# EAGLE design hs-usb-wing (EAGLE 5.06)
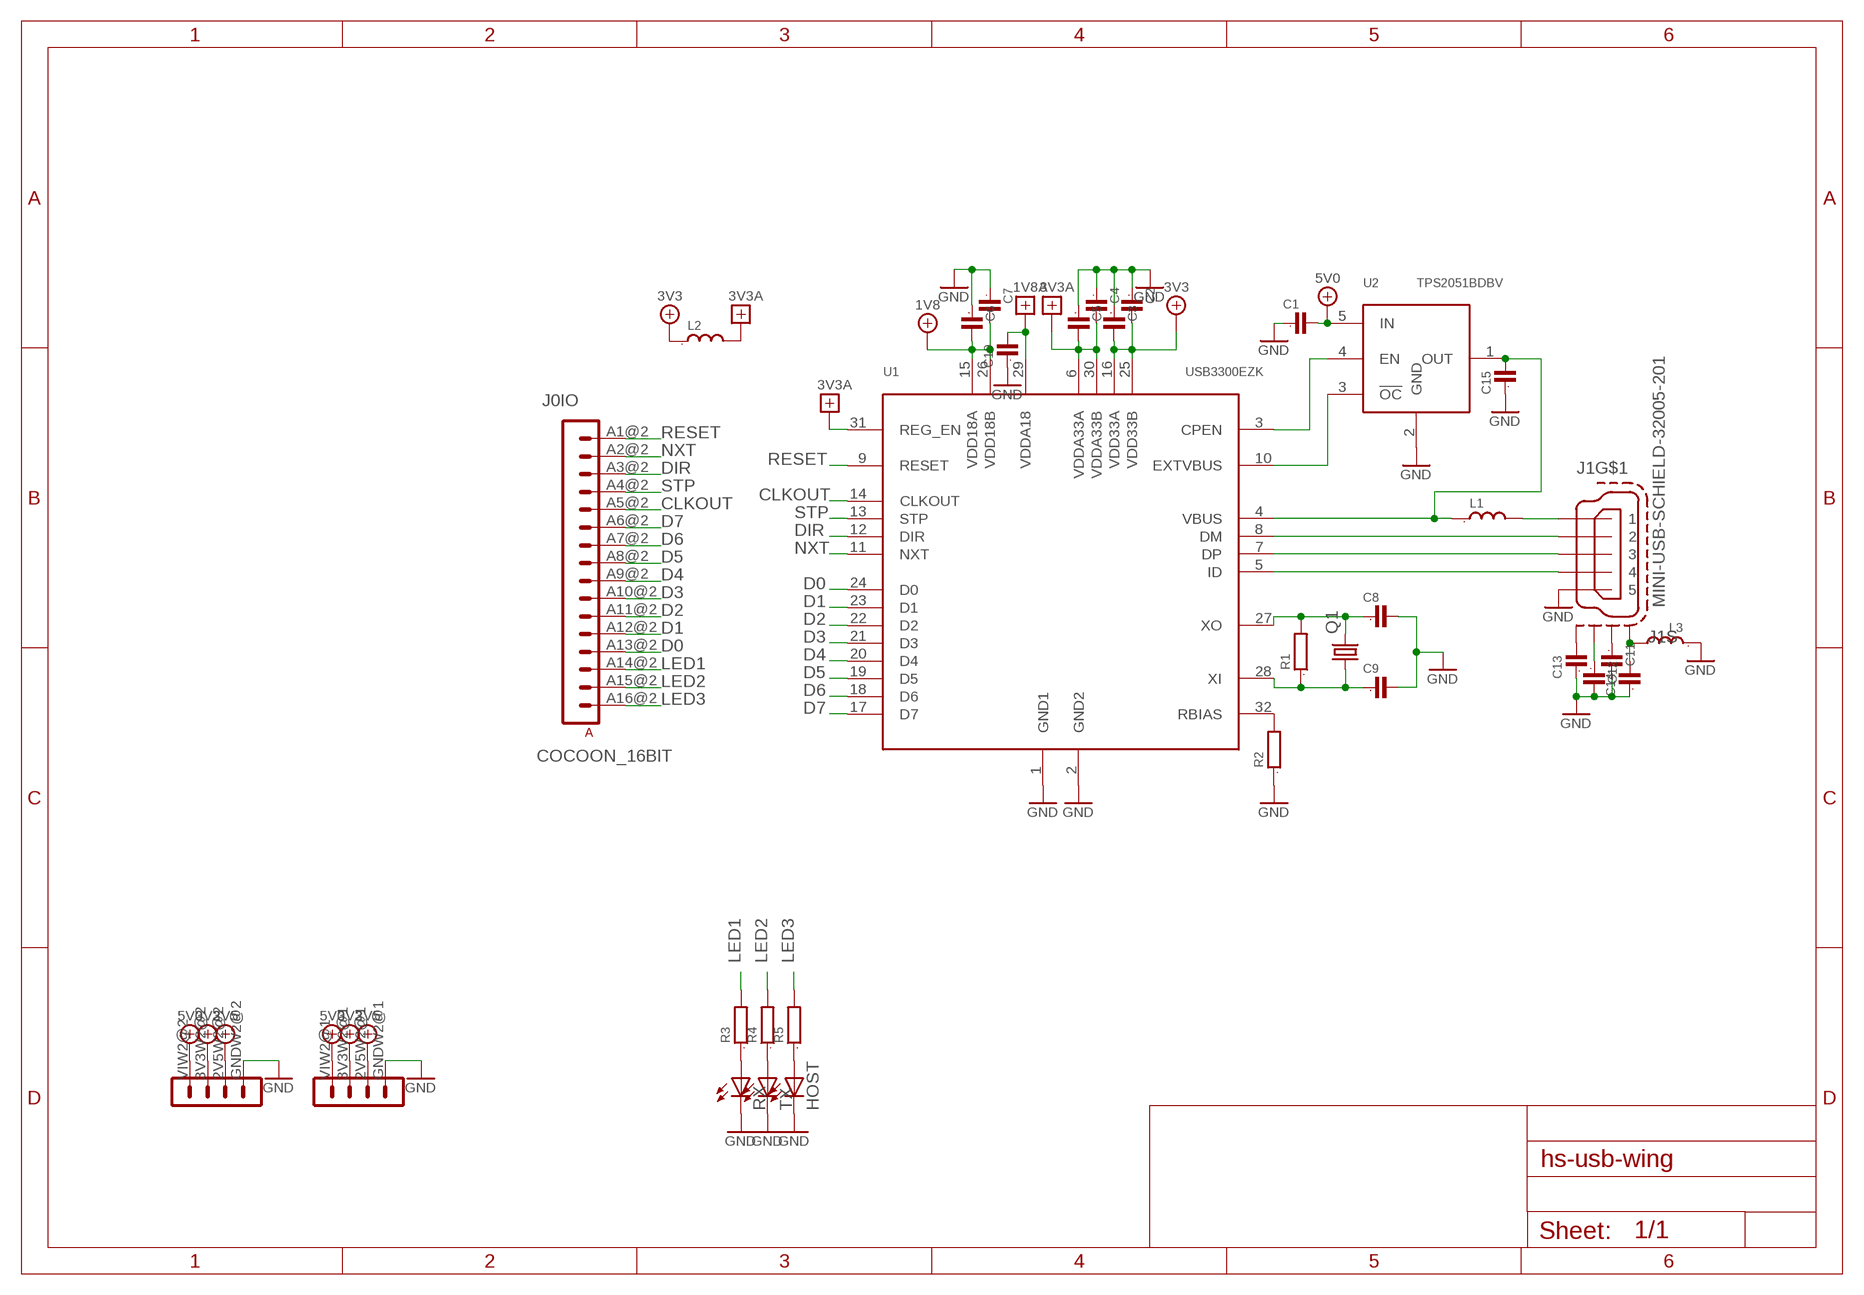
[diagram p0: schematic, sheet 1]

## Parts
C1  C0603  [0603]
C2  C0603  [0603]
C3  C0603  [0603]
C4  C0603  [0603]
C5  C0603  [0603]
C6  C0603  [0603]
C7  C0603  [0603]
C8  C0603  [0603]
C9  C0603  [0603]
C10  C0603  [0603]
C11  C0603  [0603]
C12  C0603  [0603]
C13  C0603  [0603]
C14  C0603  [0603]
C15  C0603  [0603]
HOST  LEDCHIP-LED0603  [CHIP-LED0603]
J0  COCOON_16BIT  [COCOON_16BIT_LEFT]
J1  MINI-USB-SCHIELD-32005-201  [32005-201]
L1  L0805  [0805]
L2  L0805  [0805]
L3  L0805  [0805]
Q1  CRYSTALHC49S  [HC49/S]
R1  R0603  [0603]
R2  R0603  [0603]
R3  R0603  [0603]
R4  R0603  [0603]
R5  R0603  [0603]
RX  LEDCHIP-LED0603  [CHIP-LED0603]
TX  LEDCHIP-LED0603  [CHIP-LED0603]
U1  USB3300EZK  [QFN32]
U2  TPS2051BDBV  [SOT23-DBV]

## Nets
1V8: C6.2 C7.2 U1.15(VDD18A) U1.26(VDD18B)
1V8A: C10.2 U1.29(VDDA18)
2V5: J0.2V5W2@1(PWRH:2V5) J0.2V5W2@2(PWRL:2V5)
3V3: C2.2 C3.2 J0.3V3W2@1(PWRH:3V3) J0.3V3W2@2(PWRL:3V3) L2.1 U1.16(VDD33A) U1.25(VDD33B)
3V3A: C4.2 C5.2 L2.2 U1.6(VDDA33A) U1.30(VDDA33B) U1.31(REG_EN)
5V0: C1.2 J0.VIW2@1(PWRH:5V) J0.VIW2@2(PWRL:5V) U2.5(IN)
CLKOUT: J0.A5@2(IO:A5) U1.14(CLKOUT)
D0: J0.A13@2(IO:A13) U1.24(D0)
D1: J0.A12@2(IO:A12) U1.23(D1)
D2: J0.A11@2(IO:A11) U1.22(D2)
D3: J0.A10@2(IO:A10) U1.21(D3)
D4: J0.A9@2(IO:A9) U1.20(D4)
D5: J0.A8@2(IO:A8) U1.19(D5)
D6: J0.A7@2(IO:A7) U1.18(D6)
D7: J0.A6@2(IO:A6) U1.17(D7)
DIR: J0.A3@2(IO:A3) U1.12(DIR)
DM: J1.2 U1.8(DM)
DP: J1.3 U1.7(DP)
GND: C1.1 C2.1 C3.1 C4.1 C5.1 C6.1 C7.1 C8.2 C9.2 C10.1 C11.2 C12.2 C13.1 C14.1 C15.1 HOST.C J0.GNDW2@1(PWRH:GND) J0.GNDW2@2(PWRL:GND) J1.5 L3.1 R2.1 RX.C TX.C U1.1(GND1) U1.2(GND2) U2.2(GND)
ID: J1.4 U1.5(ID)
LED1: J0.A14@2(IO:A14) R3.2
LED2: J0.A15@2(IO:A15) R4.2
LED3: J0.A16@2(IO:A16) R5.2
N$1: R3.1 RX.A
N$2: J1.1 L1.2
N$3: R4.1 TX.A
N$5: R2.2 U1.32(RBIAS)
N$6: C8.1 Q1.2 R1.2 U1.27(XO)
N$7: C9.1 Q1.1 R1.1 U1.28(XI)
N$8: HOST.A R5.1
N$9: C13.2 J1.M1(S:S1)
N$10: C12.1 J1.M2(S:S2)
N$11: C11.1 J1.M3(S:S3)
N$12: C14.2 J1.M4(S:S4) L3.2
N$38: U1.3(CPEN) U2.4(EN)
N$39: U1.10(EXTVBUS) U2.3(!OC)
NXT: J0.A2@2(IO:A2) U1.11(NXT)
RESET: J0.A1@2(IO:A1) U1.9(RESET)
STP: J0.A4@2(IO:A4) U1.13(STP)
VBUS: C15.2 L1.1 U1.4(VBUS) U2.1(OUT)

## Library data of the parts
C1-C15 = GadgetFactory:C: CAPACITOR, European symbol
HOST RX TX = led:LED: LED OSRAM: - CHIPLED LG R971, LG N971, LY N971, LG Q971, LY Q971, LO R971, LY R971 LH N974, LH R974 LS Q976, LO Q976, LY Q976 LO Q996 - Hyper CHIPLED LW Q18S LB Q993, LB Q99A, LB R99A - SideLED LS A670, LO A670, LY A670, LG A670, LP A670 LB A673, LV A673, LT A673, LW A673 LH A674 LY A675 LS A676, LA A676, LO A676, LY A676, LW A676 LS A679, LY A679, LG A679 - Hyper Micro SIDELED® LS Y876, LA Y876, LO Y876, LY Y876 LT Y87S - SmartLED LW L88C, LW L88S LB L89C, LB L89S, LG L890 LS L89K, LO L89K, LY L89K LS L896, LA L896, LO L896, LY L896 - TOPLED LS T670, LO T670, LY T670, LG T670, LP T670 LSG T670, LSP T670, LSY T670, LOP T670, LYG T670 LG T671, LOG T671, LSG T671 LB T673, LV T673, LT T673, LW T673 LH T674 LS T676, LA T676, LO T676, LY T676, LB T676, LH T676, LSB T676, LW T676 LB T67C, LV T67C, LT T67C, LS T67K, LO T67K, LY T67K, LW E67C LS E67B, LA E67B, LO E67B, LY E67B, LB E67C, LV E67C, LT E67C LW T67C LS T679, LY T679, LG T679 LS T770, LO T770, LY T770, LG T770, LP T770 LB T773, LV T773, LT T773, LW T773 LH T774 LS E675, LA E675, LY E675, LS T675 LS T776, LA T776, LO T776, LY T776, LB T776 LHGB T686 LT T68C, LB T68C - Hyper Mini TOPLED® LB M676 - Mini TOPLED Santana® LG M470 LS M47K, LO M47K, LY M47K Source: http://www.osram.convergy.de LUXEON: - LUMILED® LXK2-PW12-R00, LXK2-PW12-S00, LXK2-PW14-U00, LXK2-PW14-V00 LXK2-PM12-R00, LXK2-PM12-S00, LXK2-PM14-U00 LXK2-PE12-Q00, LXK2-PE12-R00, LXK2-PE12-S00, LXK2-PE14-T00, LXK2-PE14-U00 LXK2-PB12-K00, LXK2-PB12-L00, LXK2-PB12-M00, LXK2-PB14-N00, LXK2-PB14-P00, LXK2-PB14-Q00 LXK2-PR12-L00, LXK2-PR12-M00, LXK2-PR14-Q00, LXK2-PR14-R00 LXK2-PD12-Q00, LXK2-PD12-R00, LXK2-PD12-S00 LXK2-PH12-R00, LXK2-PH12-S00 LXK2-PL12-P00, LXK2-PL12-Q00, LXK2-PL12-R00 Source: www.luxeon.com KINGBRIGHT: KA-3528ASYC Source: www.kingbright.com
J0 = usb1:COCOON_16BIT
J1 = con-cypressindustries:MINI-USB-SCHIELD-: MINI USB-B Conector Source: www.cypressindustries.com
L1-L3 = GadgetFactory:L: INDUCTOR, European symbol
Q1 = usb1:CRYSTAL: CRYSTAL
R1-R5 = GadgetFactory:R: RESISTOR, European symbol
U1 = usb1:USB3300
U2 = usb1:TPS2051B

## Board
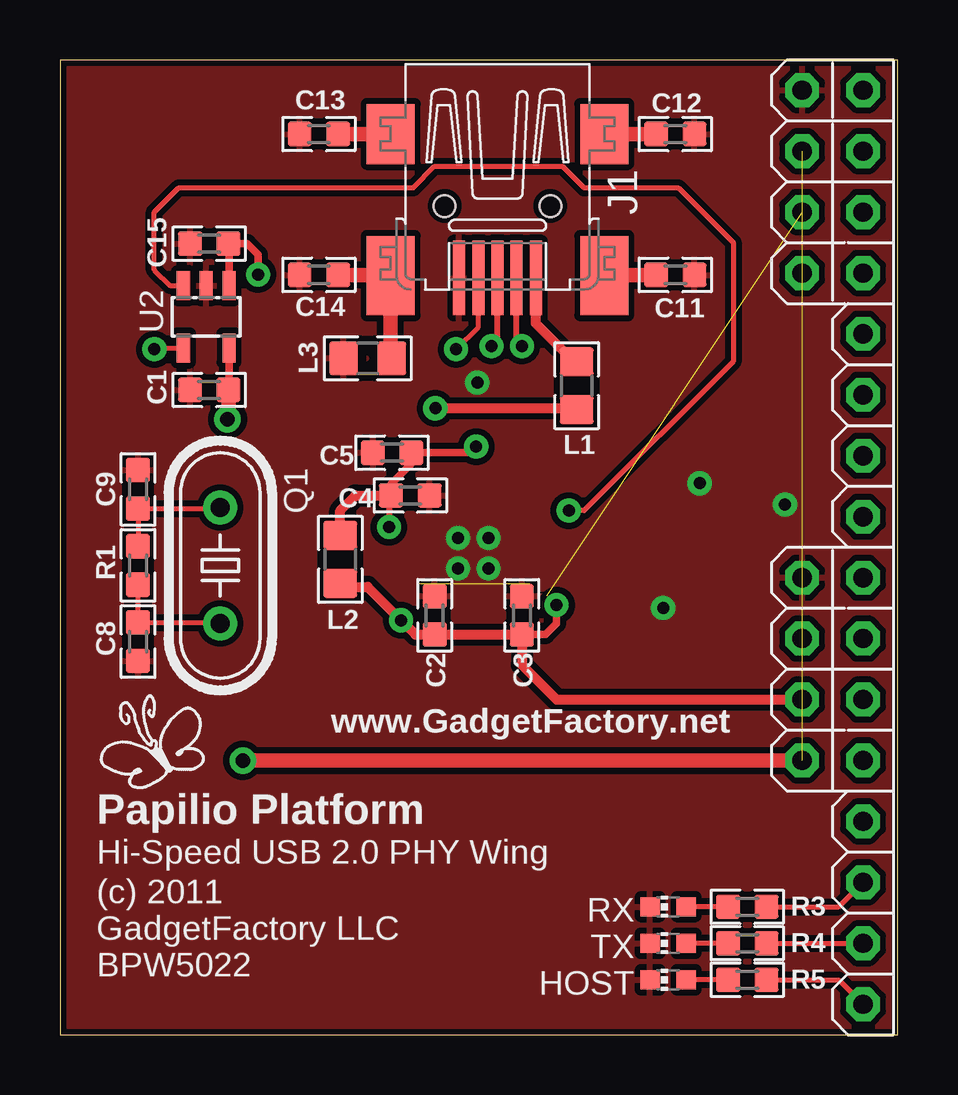
[diagram p1: board, top side]
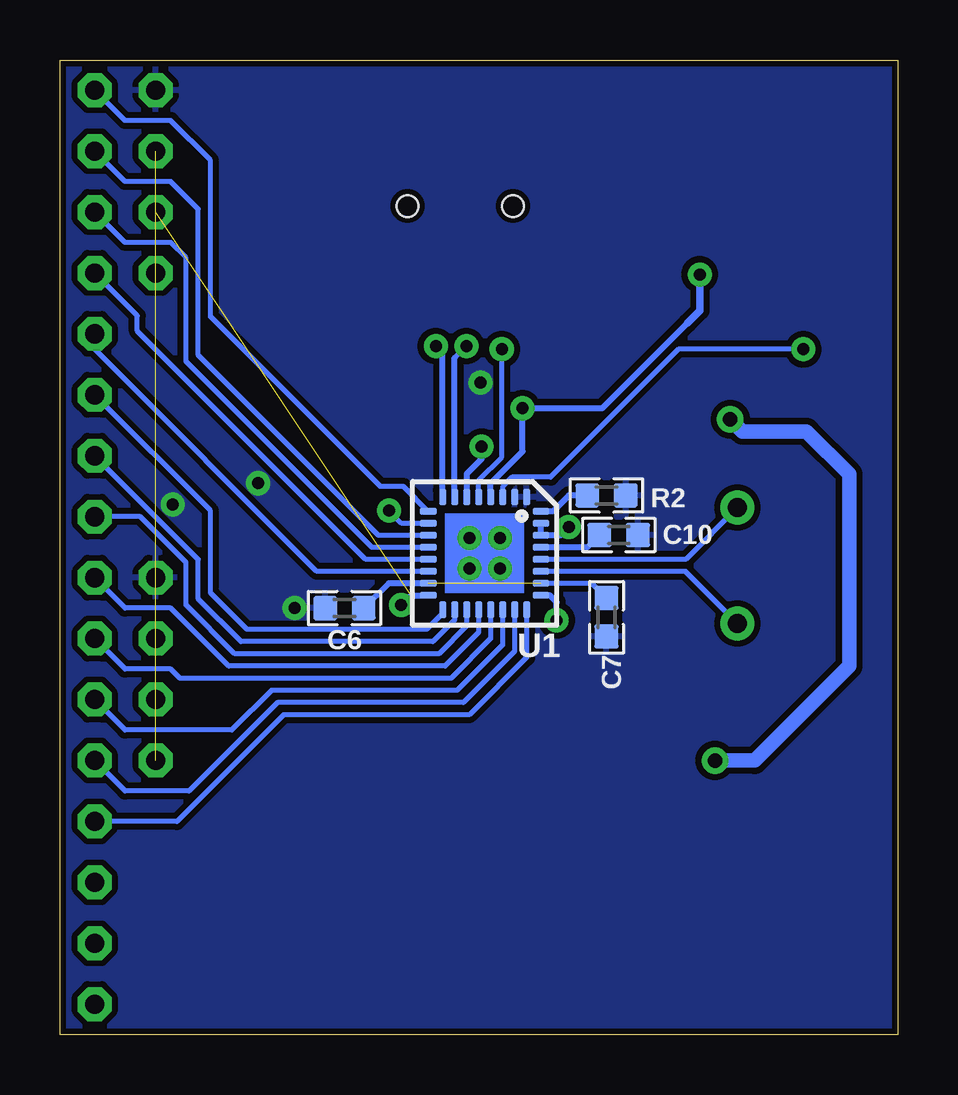
[diagram p2: board, bottom side, seen from below]

Size 34.93 x 40.63 mm. Coordinates in mm from the lower left corner, seen from the top.
Outline: 0,0 34.93,0 34.93,40.63 0,40.63 0,0
Copper layers (1*16): Top 0.035mm / dielectric 1.5mm / Bottom 0.035mm
Design rules "SparkFun_Derived_GoldePheonix_10mil *": minimum track width 10mil, minimum drill 15mil, track to track 8mil, track to pad 8mil, pad to pad 8mil, via to via 8mil, smd to smd 8mil, copper to edge 8mil, drill to drill 8mil, minimum pad ring 12mil, minimum via ring 10mil, stop-mask expansion 4mil, vias tented up to drill 18mil, thermal gap 10mil

### Footprints (pad centres in the part's own frame; a part is rotated, then mirrored left to right if it is on the bottom)
0603 = smd 1 x 1: 1 -0.8,0; 2 0.8,0
CHIP-LED0603 = smd 0.8 x 0.8: A 0,-0.75; C 0,0.75
COCOON_16BIT_LEFT = drill 0.8 octagon: 2V5W2@1 -1.27,16.51; 2V5W2@2 -1.27,-3.81; 3V3W2@1 -1.27,13.97; 3V3W2@2 -1.27,-6.35; A1@2 1.27,19.05; A2@2 1.27,16.51; A3@2 1.27,13.97; A4@2 1.27,11.43; A5@2 1.27,8.89; A6@2 1.27,6.35; A7@2 1.27,3.81; A8@2 1.27,1.27; A9@2 1.27,-1.27; A10@2 1.27,-3.81; A11@2 1.27,-6.35; A12@2 1.27,-8.89; A13@2 1.27,-11.43; A14@2 1.27,-13.97; A15@2 1.27,-16.51; A16@2 1.27,-19.05; GNDW2@1 -1.27,19.05; GNDW2@2 -1.27,-1.27; VIW2@1 -1.27,11.43; VIW2@2 -1.27,-8.89
32005-201 = smd 3.1 x 0.5: 1 3,1.6; 2 3,0.8; 3 3,0; 4 3,-0.8; 5 3,-1.6 | smd 2.5 x 2: M1 -3,-4.45; M2 -3,4.45 | smd 3.3 x 2: M3 2.9,4.45; M4 2.9,-4.45 | hole 0.9: 0,2.2; 0,-2.2
0805 = smd 1.2 x 1.4: 1 -1,0; 2 1,0
HC49/S = drill 0.8 round: 1 -2.413,0; 2 2.413,0
QFN32 = smd 0.7 x 0.3: 1 -2.35,1.75; 2 -2.35,1.25; 3 -2.35,0.75; 4 -2.35,0.25; 5 -2.35,-0.25; 6 -2.35,-0.75; 7 -2.35,-1.25; 8 -2.35,-1.75; 17 2.35,-1.75; 18 2.35,-1.25; 19 2.35,-0.75; 20 2.35,-0.25; 21 2.35,0.25; 22 2.35,0.75; 23 2.35,1.25; 24 2.35,1.75 | smd 0.3 x 0.7: 9 -1.75,-2.35; 10 -1.25,-2.35; 11 -0.75,-2.35; 12 -0.25,-2.35; 13 0.25,-2.35; 14 0.75,-2.35; 15 1.25,-2.35; 16 1.75,-2.35; 25 1.75,2.35; 26 1.25,2.35; 27 0.75,2.35; 28 0.25,2.35; 29 -0.25,2.35; 30 -0.75,2.35; 31 -1.25,2.35; 32 -1.75,2.35
SOT23-DBV = smd 0.55 x 1.2: 1 -0.95,-1.3; 2 0,-1.3; 3 0.95,-1.3; 4 0.95,1.3; 5 -0.95,1.3

### Placement (x,y rotation side)
C1  6.22,26.88 0 top
C2  15.62,17.48 270 top
C3  19.26,17.48 270 top
C4  14.61,22.48 180 top
C5  13.84,24.26 0 top
C6  23.07,17.78 0 bottom
C7  12.14,17.4 90 bottom
C8  3.25,16.38 270 top
C9  3.25,22.73 90 top
C10  11.64,20.83 180 bottom
C11  25.65,31.67 0 top
C12  25.65,37.54 0 top
C13  10.79,37.54 0 top
C14  10.79,31.67 0 top
C15  6.22,32.97 0 top
HOST  25.35,2.29 90 top
J0  32.21,20.32 0 top
J1  18.24,34.54 270 top
L1  21.54,27.05 90 top
L2  11.68,19.81 90 top
L3  12.83,28.19 0 top
LOGO1  BUTTERFLY_LOGO  [BUTTERFLY_LOGO]  3.94,11.68 0 top
Q1  6.68,19.56 270 top
R1  3.25,19.56 270 top
R2  12.14,22.48 180 bottom
R3  28.65,5.33 0 top
R4  28.65,3.81 0 top
R5  28.65,2.29 0 top
RX  25.35,5.33 90 top
TX  25.35,3.81 90 top
U1  17.22,20.07 270 bottom
U2  6.1,29.92 180 top

### Tracks (layer width: path | path; a pad name or v marks a point on that pad's centre or on a via)
1V8  (1 unrouted)
  Bottom 0.203: U1.26 12.76,18.82 C7.2
  Bottom 0.254: U1.15 21.23,18.82 C6.2
1V8A
  Bottom 0.254: U1.29 12.95,20.32 C10.2
2V5  (1 unrouted)
3V3  (via drill 0.5)  (1 unrouted)
  Top 0.254: L2.1 11.83,18.67
  Top 0.305: C3.2 20.23,16.68 20.7,17.14 v20.7,17.91
  Top 0.406: J0.3V3W2@2 20.7,13.97 19.26,15.41 C3.2 C2.2 14.82,16.68 v14.22,17.27 12.83,18.67 11.83,18.67
  Bottom 0.254: U1.16 20.29,18.32 v20.7,17.91 | U1.25 14.51,18.32 14.22,18.03 v14.22,17.27
3V3A  (via drill 0.5)
  Top 0.254: C4.2 13.72,22.39 v13.72,21.16
  Top 0.305: v17.35,24.51 17.1,24.26 C5.2 14.64,23.79 13.8,22.95 C4.2
  Top 0.406: L2.2 11.68,21.84 12.32,22.48 C4.2
  Bottom 0.254: U1.6 17.97,23.38 17.35,24 v17.35,24.51 | U1.31 U1.30 14.06,20.82 v13.72,21.16
5V0  (via drill 0.6)  (1 unrouted)
  Top 0.305: U2.5 7.05,26.9 C1.2
  Top 0.61: C1.2 7.02,25.69 v6.99,25.65 | v7.62,11.43 J0.VIW2@2
  Bottom 0.61: v6.99,25.65 6.48,25.15 3.81,25.15 2.03,23.37 2.03,15.37 5.97,11.43 v7.62,11.43
CLKOUT
  Bottom 0.203: J0.A5@2 33.48,28.57 24.22,19.32 U1.14
D0
  Bottom 0.203: J0.A13@2 30.05,8.89 25.61,13.34 17.86,13.34 15.47,15.72 U1.24
D1
  Bottom 0.203: U1.23 15.97,15.98 18.11,13.84 25.86,13.84 29.54,10.16 32.21,10.16 J0.A12@2
D2
  Bottom 0.203: U1.22 16.47,16.24 18.37,14.35 26.11,14.35 27.77,12.7 32.21,12.7 J0.A11@2
D3
  Bottom 0.203: U1.21 16.97,16.51 18.62,14.86 29.92,14.86 30.3,15.24 32.21,15.24 J0.A10@2
D4
  Bottom 0.203: U1.20 17.47,16.77 18.88,15.37 27.89,15.37 30.3,17.78 32.21,17.78 J0.A9@2
D5
  Bottom 0.203: U1.19 17.97,17.03 19.13,15.88 27.64,15.88 29.67,17.91 29.67,19.68 31.57,21.59 J0.A8@2
D6
  Bottom 0.203: U1.18 18.47,17.29 19.38,16.38 27.38,16.38 29.16,18.16 29.16,19.81 J0.A7@2
D7
  Bottom 0.203: U1.17 18.97,17.55 19.64,16.89 27.13,16.89 28.65,18.41 28.65,21.84 J0.A6@2
DIR
  Bottom 0.203: J0.A3@2 32.21,33.02 30.3,33.02 29.67,32.38 29.67,28.07 21.92,20.32 U1.12
DM  (via drill 0.5)
  Top 0.254: J1.2 19.04,28.92 v19.26,28.7
  Bottom 0.203: 18.97,28.42 v19.26,28.7
  Bottom 0.254: U1.8 18.97,28.42
DP  (via drill 0.5)
  Top 0.254: J1.3 18.24,28.96 v17.99,28.7
  Bottom 0.203: 18.47,28.21 v17.99,28.7
  Bottom 0.254: U1.7 18.47,28.21
GND  (via drill 0.5)
  other vias: 16.59,20.7 16.59,19.43 17.86,19.43 17.86,20.7 25.15,17.78 30.23,22.1 26.67,22.99 17.4,27.18
  pour Top (isolate 0.254): 0,0 34.75,0 34.75,40.64 0,40.64
  pour Bottom (isolate 0.254): 0,0 34.75,0 34.75,40.64 0,40.64
ID  (via drill 0.5)
  Top 0.203: J1.4 17.44,29.5 v16.51,28.57
  Bottom 0.203: U1.5 17.47,23.12 16.51,24.08 v16.51,28.57
LED1
  Top 0.203: R3.2 32.46,5.33 J0.A14@2
LED2
  Top 0.203: R4.2 J0.A15@2
LED3
  Top 0.203: R5.2 32.46,2.29 J0.A16@2
N$1
  Top 0.203: R3.1 RX.A
N$2
  Top 0.406: J1.1 19.84,29.64 21.43,28.05 L1.2
N$3
  Top 0.203: R4.1 TX.A
N$5
  Bottom 0.254: R2.2 13.72,22.48 14.38,21.82 U1.32
N$6
  Top 0.203: Q1.2 6.64,17.18 C8.1 R1.2
  Bottom 0.203: U1.27 8.85,19.32 Q1.2
N$7
  Top 0.203: R1.1 C9.1 6.64,21.93 Q1.1
  Bottom 0.203: U1.28 8.84,19.82 Q1.1
N$8
  Top 0.203: R5.1 HOST.A
N$9
  Top 0.61: C13.2 J1.M1
N$10
  Top 0.61: J1.M2 C12.1
N$11
  Top 0.61: J1.M3 22.72,31.67 C11.1
N$12
  Top 0.406: L3.2 13.79,28.23
  Top 0.61: 13.79,28.23 J1.M4 13.76,31.67 C14.2
N$38  (via drill 0.5)
  Top 0.203: U2.4 3.99,28.62 v3.94,28.57
  Bottom 0.203: U1.3 16.47,22.85 16.08,23.24 14.48,23.24 9.14,28.57 v3.94,28.57
N$39  (via drill 0.5)
  Top 0.203: U2.3 4.59,31.22 3.94,31.88 3.94,34.29 4.95,35.31 14.73,35.31 15.62,36.2 20.95,36.2 21.84,35.31 25.78,35.31 28.07,33.02 28.07,28.07 21.84,21.84 v21.21,21.84
  Bottom 0.203: U1.10 20.68,21.32 v21.21,21.84
NXT
  Bottom 0.203: U1.11 21.66,20.82 29.16,28.32 29.16,34.42 30.3,35.56 32.21,35.56 J0.A2@2
RESET
  Bottom 0.203: J0.A1@2 32.21,38.1 30.3,38.1 28.65,36.45 28.65,29.92 21.59,22.86 20.62,22.86 U1.9
STP
  Bottom 0.203: J0.A4@2 31.7,29.97 31.7,29.34 22.18,19.82 U1.13
VBUS  (via drill 0.5)
  Top 0.254: C15.2 7.04,32.96
  Top 0.305: U2.1 7.05,32.95 C15.2 7.79,32.97 8.26,32.51 v8.26,31.69
  Top 0.406: v15.65,26.11 21.48,26.11 L1.1
  Bottom 0.254: U1.4 16.97,22.98 15.65,24.31 v15.65,26.11 12.32,26.11 8.76,29.67
  Bottom 0.305: 8.76,29.67 8.26,30.18 v8.26,31.69

### Text on the board
tPlace: www.GadgetFactory.net | Papilio Platform | Hi-Speed USB 2.0 PHY Wing | (c) 2011 | GadgetFactory LLC | BPW5022